# EAGLE schematic h bridge (EAGLE 6.4)
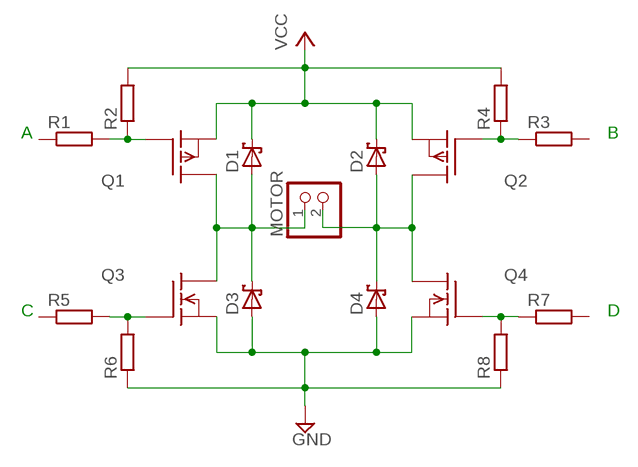
[diagram p0: schematic, sheet 1]

## Parts
D1  1N6267A  [C4111-15]
D2  1N6267A  [C4111-15]
D3  1N6267A  [C4111-15]
D4  1N6267A  [C4111-15]
MOTOR  PINHD-1X2  [1X02]
Q1  TP0602N2  [TO-39]
Q2  TP0602N2  [TO-39]
Q3  SUP75N06-08  [TO220]
Q4  SUP75N06-08  [TO220]
R1  R-EU_0204/7  [0204/7]
R2  R-EU_0204/7  [0204/7]
R3  R-EU_0204/7  [0204/7]
R4  R-EU_0204/7  [0204/7]
R5  R-EU_0204/7  [0204/7]
R6  R-EU_0204/7  [0204/7]
R7  R-EU_0204/7  [0204/7]
R8  R-EU_0204/7  [0204/7]

## Nets
GND: D3.A D4.A Q3.3(S) Q4.3(S) R6.1 R8.1
N$1: Q1.2(G) R1.2 R2.1
N$2: D2.A D4.C MOTOR.2 Q2.3(D) Q4.2(D)
N$3: Q2.2(G) R3.1 R4.1
N$4: Q3.1(G) R5.2 R6.2
N$5: Q4.1(G) R7.1 R8.2
N$9: D1.A D3.C MOTOR.1 Q1.3(D) Q3.2(D)
VCC: D1.C D2.C Q1.1(S) Q2.1(S) R2.2 R4.2
Unconnected: R1.1 R3.2 R5.1 R7.2

## Notes on the sheet
- A | B
- C | D

## Library data of the parts
D1-D4 = diode:1N6267A: DIODE transient voltage suppressor
MOTOR = pinhead:PINHD-1X2: PIN HEADER
Q1 Q2 = transistor-fet:TP0602N2: P-Channel Enhancement MOSFET -20V; -2A; 2,0Ohm
Q3 Q4 = transistor-fet:SUP75N06-08: N-Channel Enhancement MOSFET 60V; 75A; 0,008Ohm
R1-R8 = rcl:R-EU_: RESISTOR, European symbol